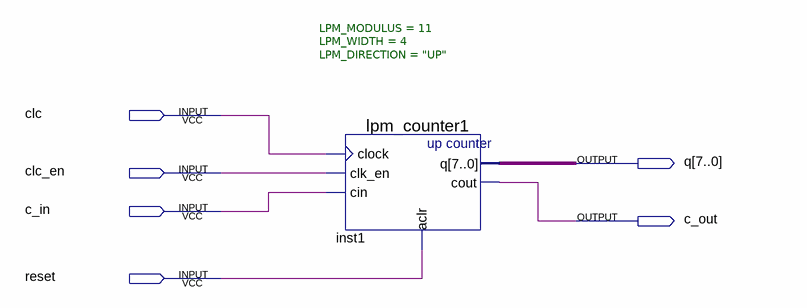
[diagram p0: schematic sheet]
// Quartus schematic lab_9.bdf as structural Verilog: 1 symbols, 6 pins
module lab_9 (
  input  clc,
  input  clc_en,
  input  c_in,
  input  reset,
  output [7:0] q,
  output c_out
);

  lpm_counter1 #(.LPM_MODULUS(11), .LPM_WIDTH(4), .LPM_DIRECTION("UP")) inst1 (
    .clock(clc), .clk_en(clc_en), .cin(c_in), .aclr(reset), .q(q), .cout(c_out));
endmodule
